# EAGLE design Pi MCU shield (EAGLE 6.4)
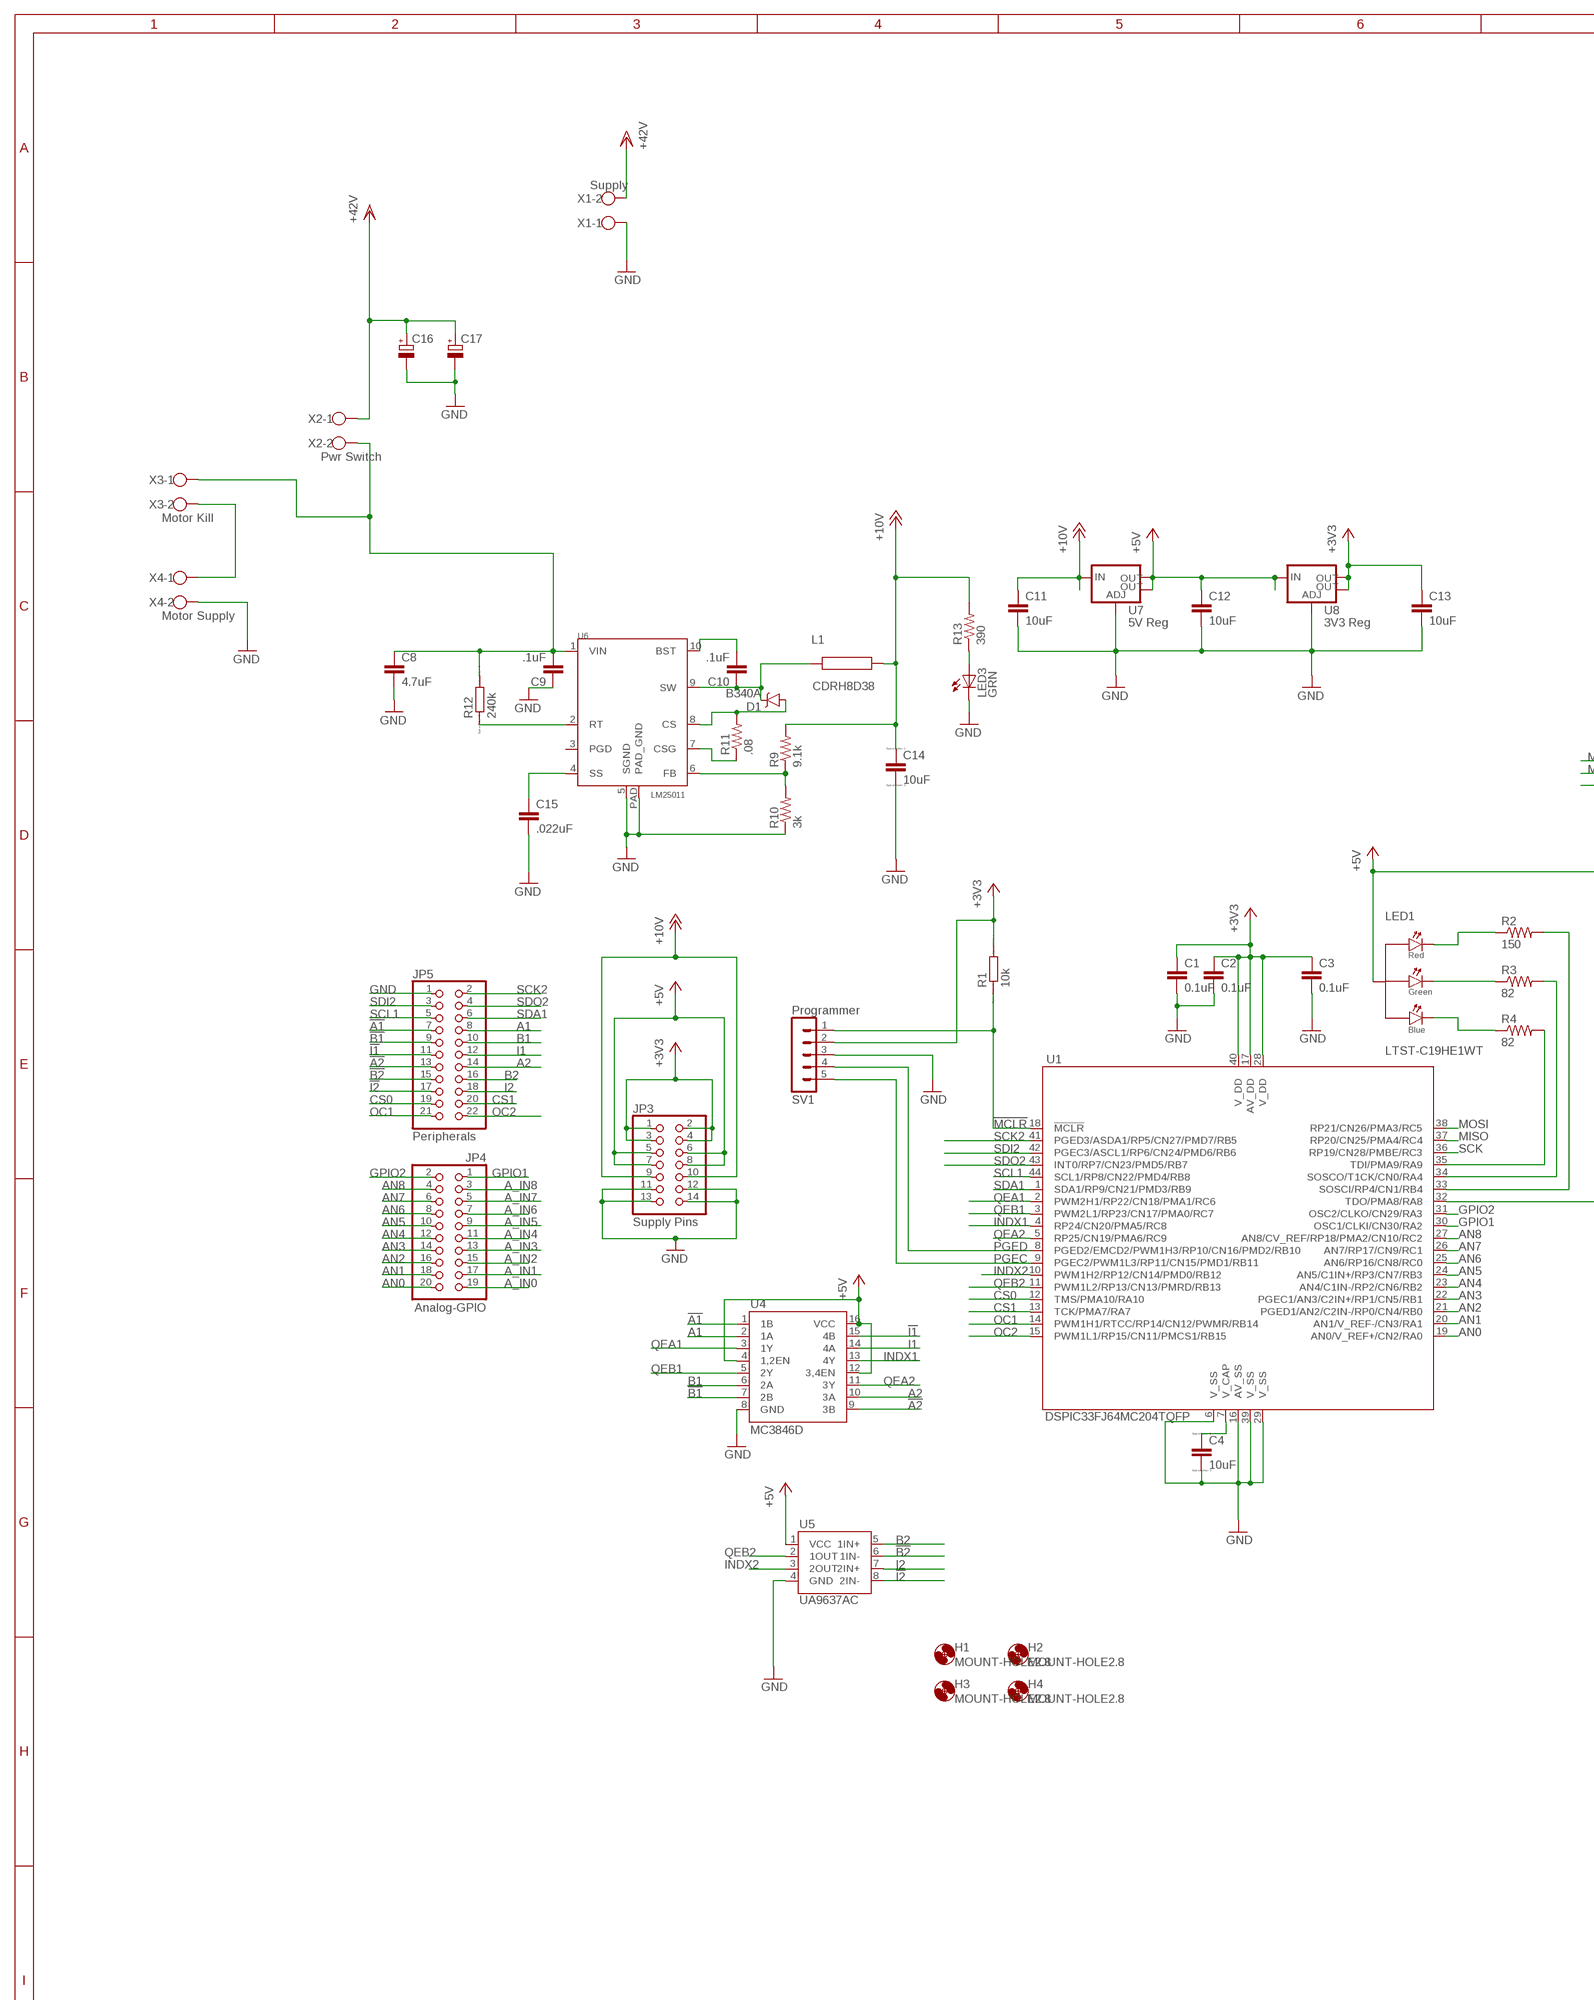
[diagram p0: schematic, sheet 1, part 1 of 2]
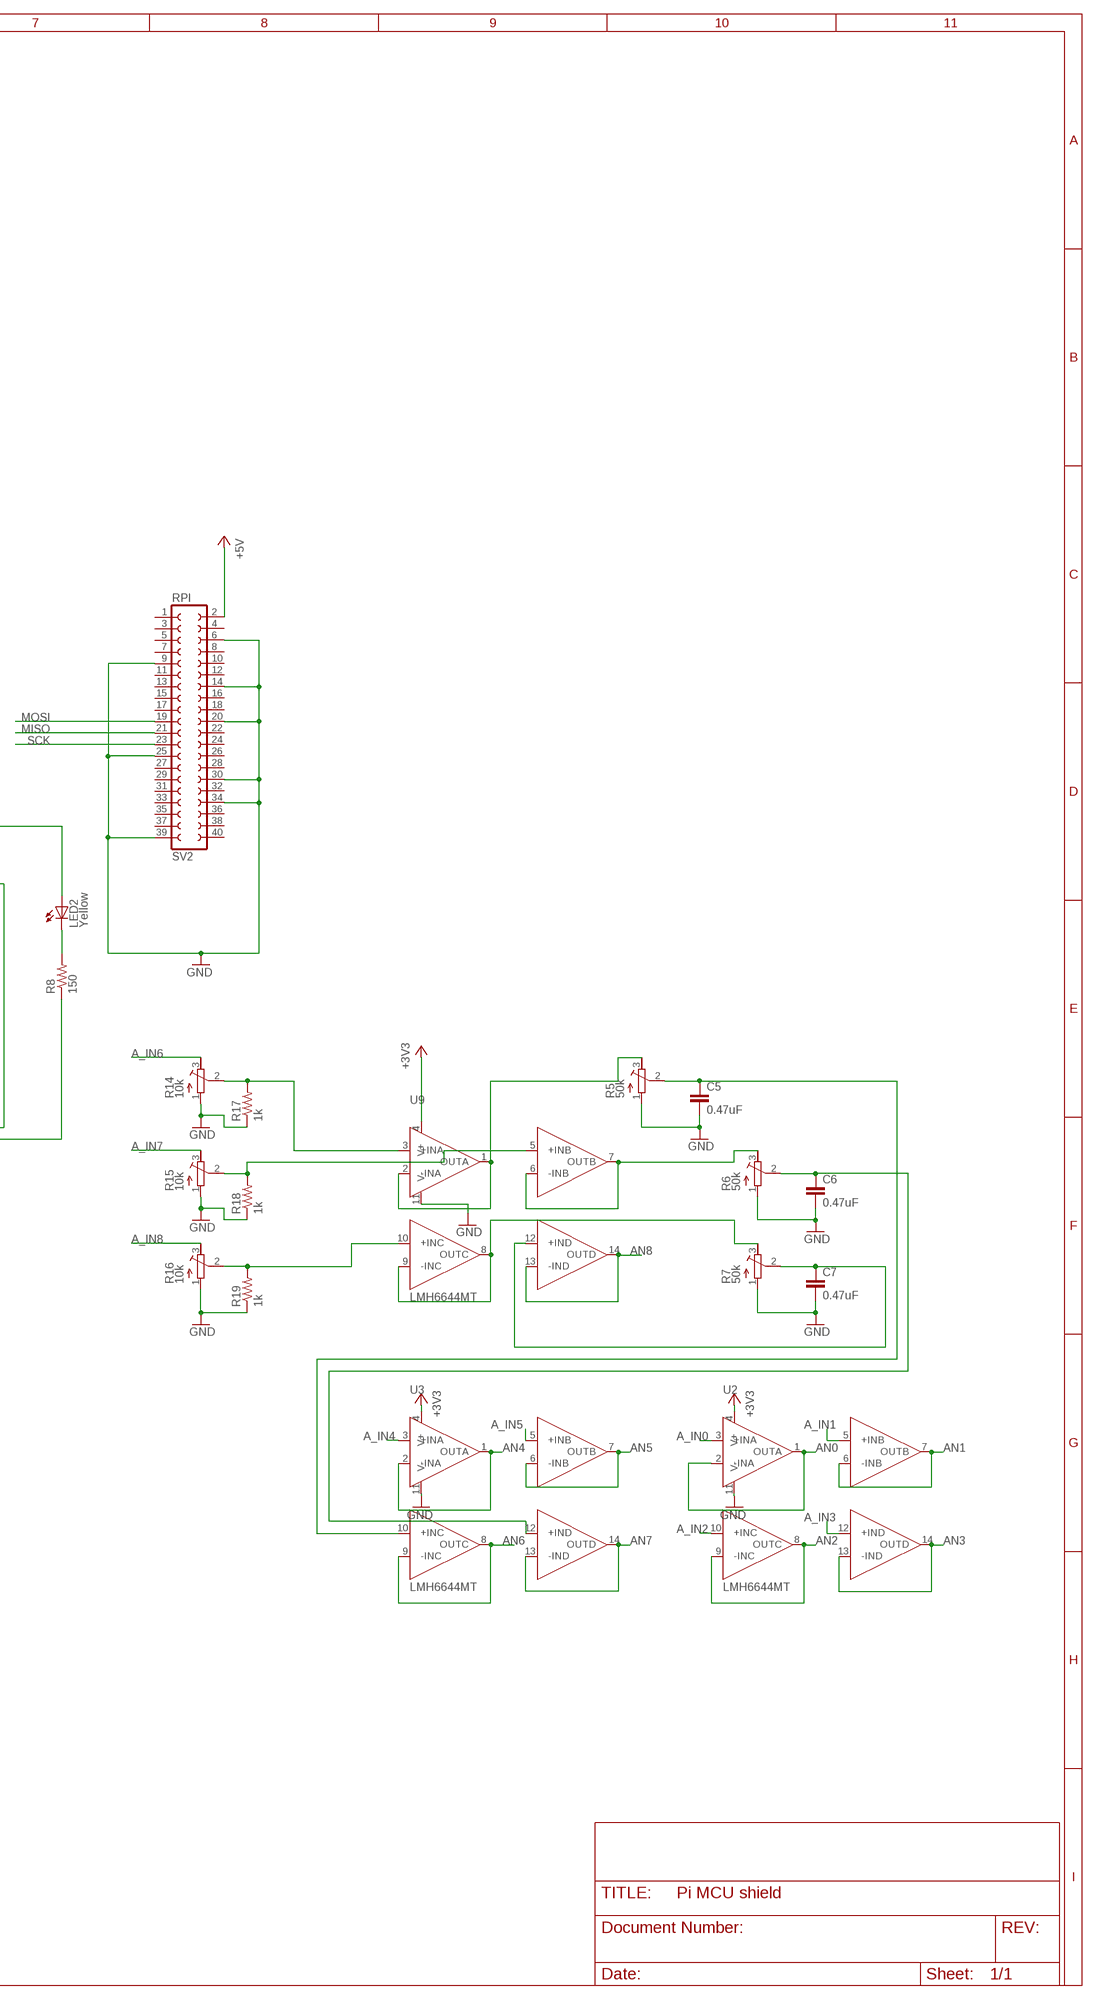
[diagram p1: schematic, sheet 1, part 2 of 2]

## Parts
C1  0.1uF  C-EUC0603  [C0603]
C2  0.1uF  C-EUC0603  [C0603]
C3  0.1uF  C-EUC0603  [C0603]
C4  10uF  CC1206  [C1206]
C5  0.47uF  C-EUC0603  [C0603]
C6  0.47uF  C-EUC0603  [C0603]
C7  0.47uF  C-EUC0603  [C0603]
C8  4.7uF  C-EUC1210  [C1210]
C9  .1uF  CAP0603-CAP  [0603-CAP]
C10  .1uF  CAP0603-CAP  [0603-CAP]
C11  10uF  C-EUC0805  [C0805]
C12  10uF  C-EUC0805  [C0805]
C13  10uF  C-EUC0805  [C0805]
C14  10uF  CC1206  [C1206]
C15  .022uF  CAP0603-CAP  [0603-CAP]
C16  CPOL-EUE5-13  [E5-13]
C17  CPOL-EUE5-13  [E5-13]
D1  B340A  DIODE-SCHOTTKY-B340A  [SMA-DIODE]
H1  MOUNT-HOLE2.8  [2,8]
H2  MOUNT-HOLE2.8  [2,8]
H3  MOUNT-HOLE2.8  [2,8]
H4  MOUNT-HOLE2.8  [2,8]
JP3  Supply Pins  PINHD-2X7  [2X07]
JP4  Analog-GPIO  PINHD-2X10  [2X10]
JP5  Peripherals  PINHD-2X11  [2X11]
L1  CDRH8D38  [CDRH8D38]
LED1  LTST-C19HE1WT  [0606]
LED2  Yellow  LEDSML0603  [SML0603]
LED3  GRN  LEDCHIP-LED0805  [CHIP-LED0805]
R1  10k  R  [R0805]
R2  150  R-US_R0603  [R0603]
R3  82  R-US_R0603  [R0603]
R4  82  R-US_R0603  [R0603]
R5  50k  R-TRIMM3224J  [RTRIM3224J]
R6  50k  R-TRIMM3224J  [RTRIM3224J]
R7  50k  R-TRIMM3224J  [RTRIM3224J]
R8  150  R-US_R0603  [R0603]
R9  9.1k  RESISTOR0603-RES  [0603-RES]
R10  3k  RESISTOR0603-RES  [0603-RES]
R11  .08  RESISTOR0603-RES  [0603-RES]
R12  240k  R  [R0805]
R13  390  RESISTOR0603-RES  [0603-RES]
R14  10k  R-TRIMM3224J  [RTRIM3224J]
R15  10k  R-TRIMM3224J  [RTRIM3224J]
R16  10k  R-TRIMM3224J  [RTRIM3224J]
R17  1k  R-US_R0603  [R0603]
R18  1k  R-US_R0603  [R0603]
R19  1k  R-US_R0603  [R0603]
SV1  Programmer  MA05-1  [MA05-1]
SV2  RPI  FE20-2  [FE20-2]
U1  DSPIC33FJ64MC204TQFP  [TQFP44]
U2  LMH6644MT  [TSSOP14]
U3  LMH6644MT  [TSSOP14]
U4  MC3846D  [SO-16]
U5  UA9637AC  [SO-08]
U6  LM25011  [HVSS0P-10]
U7  5V Reg  V_REG_LM1117SOT223  [SOT223]
U8  3V3 Reg  V_REG_LM1117SOT223  [SOT223]
U9  LMH6644MT  [TSSOP14]
X1  Supply  W237-102  [W237-102]
X2  Pwr Switch  W237-102  [W237-102]
X3  Motor Kill  W237-102  [W237-102]
X4  Motor Supply  W237-102  [W237-102]

## Nets
!A1: JP5.7 U4.1(1B)
!A2: JP5.13 U4.9(3B)
!B1: JP5.9 U4.7(2B)
!B2: JP5.15 U5.6(1IN-)
!I1: JP5.11 U4.15(4B)
!I2: JP5.17 U5.8(2IN-)
!MCLR: R1.1 SV1.1 U1.18(!MCLR)
+3V3: C1.1 C2.1 C3.1 C13.1 JP3.1 JP3.2 JP3.3 JP3.4 R1.2 SV1.2 U1.17(AV_DD) U1.28(V_DD) U1.40(V_DD) U2.4(V+) U3.4(V+) U8.2(OUT) U8.4(OUT) U9.4(V+)
+5V: C12.1 JP3.5 JP3.6 JP3.7 JP3.8 LED1.4(ANODE) LED2.A SV2.2 U4.4(1,2EN) U4.12(3,4EN) U4.16(VCC) U5.1(VCC) U7.2(OUT) U7.4(OUT) U8.3(IN)
+10V: C11.1 C14.1 JP3.9 JP3.10 L1.P$2 R9.2 R13.2 U7.3(IN)
A1: JP5.8 U4.2(1A)
A2: JP5.14 U4.10(3A)
A_IN0: JP4.19 U2.3(+INA)
A_IN1: JP4.17 U2.5(+INB)
A_IN2: JP4.15 U2.10(+INC)
A_IN3: JP4.13 U2.12(+IND)
A_IN4: JP4.11 U3.3(+INA)
A_IN5: JP4.9 U3.5(+INB)
A_IN6: JP4.7 R14.3(E)
A_IN7: JP4.5 R15.3(E)
A_IN8: JP4.3 R16.3(E)
AN0: JP4.20 U1.19(AN0/V_REF+/CN2/RA0) U2.1(OUTA) U2.2(-INA)
AN1: JP4.18 U1.20(AN1/V_REF-/CN3/RA1) U2.6(-INB) U2.7(OUTB)
AN2: JP4.16 U1.21(PGED1/AN2/C2IN-/RP0/CN4/RB0) U2.8(OUTC) U2.9(-INC)
AN3: JP4.14 U1.22(PGEC1/AN3/C2IN+/RP1/CN5/RB1) U2.13(-IND) U2.14(OUTD)
AN4: JP4.12 U1.23(AN4/C1IN-/RP2/CN6/RB2) U3.1(OUTA) U3.2(-INA)
AN5: JP4.10 U1.24(AN5/C1IN+/RP3/CN7/RB3) U3.6(-INB) U3.7(OUTB)
AN6: JP4.8 U1.25(AN6/RP16/CN8/RC0) U3.8(OUTC) U3.9(-INC)
AN7: JP4.6 U1.26(AN7/RP17/CN9/RC1) U3.13(-IND) U3.14(OUTD)
AN8: JP4.4 U1.27(AN8/CV_REF/RP18/PMA2/CN10/RC2) U9.13(-IND) U9.14(OUTD)
B1: JP5.10 U4.6(2A)
B2: JP5.16 U5.5(1IN+)
BLUE: LED1.2(G_CATHODE) R3.1
CS0: JP5.19 U1.12(TMS/PMA10/RA10)
CS1: JP5.20 U1.13(TCK/PMA7/RA7)
GND: C1.2 C2.2 C3.2 C4.2 C5.2 C6.2 C7.2 C8.2 C9.1 C11.2 C12.2 C13.2 C14.2 C15.2 C16.- C17.- JP3.11 JP3.12 JP3.13 JP3.14 JP5.1 LED3.C R5.1(A) R6.1(A) R7.1(A) R10.1 R14.1(A) R15.1(A) R16.1(A) R17.1 R18.1 R19.1 SV1.3 SV2.6 SV2.9 SV2.14 SV2.20 SV2.25 SV2.30 SV2.34 SV2.39 U1.6(V_SS) U1.16(AV_SS) U1.29(V_SS) U1.39(V_SS) U2.11(V-) U3.11(V-) U4.8(GND) U5.4(GND) U6.5(SGND) U6.PAD(PAD_GND) U7.1(ADJ) U8.1(ADJ) U9.11(V-) X1.1 X4.2
GPIO1: JP4.1 U1.30(OSC1/CLKI/CN30/RA2)
GPIO2: JP4.2 U1.31(OSC2/CLKO/CN29/RA3)
GREEN: LED1.3(B_CATHODE) R4.1
I1: JP5.12 U4.14(4A)
I2: JP5.18 U5.7(2IN+)
INDX1: U1.4(RP24/CN20/PMA5/RC8) U4.13(4Y)
INDX2: U1.10(PWM1H2/RP12/CN14/PMD0/RB12) U5.3(2OUT)
MISO: SV2.21 U1.37(RP20/CN25/PMA4/RC4)
MOSI: SV2.19 U1.38(RP21/CN26/PMA3/RC5)
N$1: R15.2(S) R18.2 U9.5(+INB)
N$2: C4.1 U1.7(V_CAP)
N$3: C8.1 C9.2 R12.2 U6.1(VIN) X2.2 X3.1
N$4: C7.1 R7.2(S) U9.12(+IND)
N$5: C5.1 R5.2(S) U3.10(+INC)
N$7: X3.2 X4.1
N$10: R14.2(S) R17.2 U9.3(+INA)
N$16: R6.3(E) U9.6(-INB) U9.7(OUTB)
N$18: R7.3(E) U9.8(OUTC) U9.9(-INC)
N$23: LED3.A R13.1
N$25: LED2.C R8.2
N$28: R4.2 U1.35(TDI/PMA9/RA9)
N$29: R3.2 U1.34(SOSCO/T1CK/CN0/RA4)
N$30: R2.2 U1.33(SOSCI/RP4/CN1/RB4)
N$31: R16.2(S) R19.2 U9.10(+INC)
N$32: R8.1 U1.32(TDO/PMA8/RA8)
N$33: C10.1 D1.C L1.P$1 U6.9(SW)
N$35: R9.1 R10.2 U6.6(FB)
N$36: R12.1 U6.2(RT)
N$37: C15.1 U6.4(SS)
N$38: D1.A R11.2 U6.8(CS)
N$39: C10.2 U6.10(BST)
N$40: R11.1 U6.7(CSG)
N$44: R5.3(E) U9.1(OUTA) U9.2(-INA)
N$57: C6.1 R6.2(S) U3.12(+IND)
OC1: JP5.21 U1.14(PWM1H1/RTCC/RP14/CN12/PWMR/RB14)
OC2: JP5.22 U1.15(PWM1L1/RP15/CN11/PMCS1/RB15)
PGEC: SV1.5 U1.9(PGEC2/PWM1L3/RP11/CN15/PMD1/RB11)
PGED: SV1.4 U1.8(PGED2/EMCD2/PWM1H3/RP10/CN16/PMD2/RB10)
QEA1: U1.2(PWM2H1/RP22/CN18/PMA1/RC6) U4.3(1Y)
QEA2: U1.5(RP25/CN19/PMA6/RC9) U4.11(3Y)
QEB1: U1.3(PWM2L1/RP23/CN17/PMA0/RC7) U4.5(2Y)
QEB2: U1.11(PWM1L2/RP13/CN13/PMRD/RB13) U5.2(1OUT)
RED: LED1.1(R_CATHODE) R2.1
SCK: SV2.23 U1.36(RP19/CN28/PMBE/RC3)
SCK2: JP5.2 U1.41(PGED3/ASDA1/RP5/CN27/PMD7/RB5)
SCL1: JP5.5 U1.44(SCL1/RP8/CN22/PMD4/RB8)
SDA1: JP5.6 U1.1(SDA1/RP9/CN21/PMD3/RB9)
SDI2: JP5.3 U1.42(PGEC3/ASCL1/RP6/CN24/PMD6/RB6)
SDO2: JP5.4 U1.43(INT0/RP7/CN23/PMD5/RB7)
VDD: C16.+ C17.+ X1.2 X2.1 ; supply symbol labelled +42V
Unconnected: SV2.1 SV2.3 SV2.4 SV2.5 SV2.7 SV2.8 SV2.10 SV2.11 SV2.12 SV2.13 SV2.15 SV2.16 SV2.17 SV2.18 SV2.22 SV2.24 SV2.26 SV2.27 SV2.28 SV2.29 SV2.31 SV2.32 SV2.33 SV2.35 SV2.36 SV2.37 SV2.38 SV2.40 U6.3(PGD)

## Library data of the parts
C1-C3 C5-C8 C11-C13 = resistor:C-EU: CAPACITOR, European symbol
C4 C14 = eagle-ltspice:C: CAPACITOR, European symbol; SPICEMODEL: NONE; SPICEPREFIX: C
C9 C10 C15 = SparkFun-Capacitors:CAP: Capacitor Standard 0603 ceramic capacitor, and 0.1" leaded capacitor.
C16 C17 = resistor:CPOL-EU: POLARIZED CAPACITOR, European symbol
D1 = SparkFun-DiscreteSemi:DIODE-SCHOTTKY: Schottky diodes in SFE's production catalog BAT20J 1A 23V 0.62Vf RB751 120mA 40V 0.37Vf PMEG4005EJ 0.5A 40V 0.42Vf MBRA140 1A 40V 0.5Vf B340A 3A 40V SMA; PROD_ID: DIO-09886
H1-H4 = holes:MOUNT-HOLE: MOUNTING HOLE with drill center marker
JP3 = pinhead:PINHD-2X7: PIN HEADER
JP4 = pinhead:PINHD-2X10: PIN HEADER
JP5 = pinhead:PINHD-2X11: PIN HEADER
L1 = sumida:CDRH8D38: Power Inductor - 1.8uH to 100 uH, 4mm tall, shielded
LED1 = led:LTST-C19HE1WT: RGB LED, common cathode. Vf ~ 3.3V (B, G), 2.1V (R) at 20mA.
LED2 LED3 = led:LED: LED OSRAM: - CHIPLED LG R971, LG N971, LY N971, LG Q971, LY Q971, LO R971, LY R971 LH N974, LH R974 LS Q976, LO Q976, LY Q976 LO Q996 - Hyper CHIPLED LW Q18S LB Q993, LB Q99A, LB R99A - SideLED LS A670, LO A670, LY A670, LG A670, LP A670 LB A673, LV A673, LT A673, LW A673 LH A674 LY A675 LS A676, LA A676, LO A676, LY A676, LW A676 LS A679, LY A679, LG A679 - Hyper Micro SIDELED® LS Y876, LA Y876, LO Y876, LY Y876 LT Y87S - SmartLED LW L88C, LW L88S LB L89C, LB L89S, LG L890 LS L89K, LO L89K, LY L89K LS L896, LA L896, LO L896, LY L896 - TOPLED LS T670, LO T670, LY T670, LG T670, LP T670 LSG T670, LSP T670, LSY T670, LOP T670, LYG T670 LG T671, LOG T671, LSG T671 LB T673, LV T673, LT T673, LW T673 LH T674 LS T676, LA T676, LO T676, LY T676, LB T676, LH T676, LSB T676, LW T676 LB T67C, LV T67C, LT T67C, LS T67K, LO T67K, LY T67K, LW E67C LS E67B, LA E67B, LO E67B, LY E67B, LB E67C, LV E67C, LT E67C LW T67C LS T679, LY T679, LG T679 LS T770, LO T770, LY T770, LG T770, LP T770 LB T773, LV T773, LT T773, LW T773 LH T774 LS E675, LA E675, LY E675, LS T675 LS T776, LA T776, LO T776, LY T776, LB T776 LHGB T686 LT T68C, LB T68C - Hyper Mini TOPLED® LB M676 - Mini TOPLED Santana® LG M470 LS M47K, LO M47K, LY M47K Source: http://www.osram.convergy.de LUXEON: - LUMILED® LXK2-PW12-R00, LXK2-PW12-S00, LXK2-PW14-U00, LXK2-PW14-V00 LXK2-PM12-R00, LXK2-PM12-S00, LXK2-PM14-U00 LXK2-PE12-Q00, LXK2-PE12-R00, LXK2-PE12-S00, LXK2-PE14-T00, LXK2-PE14-U00 LXK2-PB12-K00, LXK2-PB12-L00, LXK2-PB12-M00, LXK2-PB14-N00, LXK2-PB14-P00, LXK2-PB14-Q00 LXK2-PR12-L00, LXK2-PR12-M00, LXK2-PR14-Q00, LXK2-PR14-R00 LXK2-PD12-Q00, LXK2-PD12-R00, LXK2-PD12-S00 LXK2-PH12-R00, LXK2-PH12-S00 LXK2-PL12-P00, LXK2-PL12-Q00, LXK2-PL12-R00 Source: www.luxeon.com KINGBRIGHT: KA-3528ASYC Source: www.kingbright.com
R1 R12 = eagle-ltspice:R: RESISTOR, European symbol; SPICEMODEL: NONE; SPICEPREFIX: R
R2-R4 R8 R17-R19 = resistor:R-US_: RESISTOR, American symbol
R5-R7 R14-R16 = rcl:R-TRIMM: Trimm resistor
R9-R11 R13 = SparkFun-Resistors:RESISTOR: Resistor Basic schematic elements and footprints for 0603, 1206, and PTH resistors.
SV1 = con-lstb:MA05-1: PIN HEADER; OC_FARNELL: unknown; OC_NEWARK: unknown
SV2 = con-lsta:FE20-2: FEMALE HEADER; OC_FARNELL: unknown; OC_NEWARK: unknown
U1 = microchip:DSPIC33FJ64MC204: A 16-bit microcontroller/digital signal processor with 26 reprogrammable i/o pins,35 total i/o pins, and support for encoders, pwm output (output compare), input capture, SPI/I2C/UART serial communication, and 9 ADC channels.
U2 U3 U9 = texas:LMH6644: Fast op amps for ADC buffering. 130 MHz, full power bandwidth 40MHz, 130V/us slew rate.
U4 = texas:MC3846: Quadruple differential line receiver. 5V supply, 3 state output.
U5 = texas:UA9637AC: Dual differential line receiver, 5V supply, 8 pins.
U6 = SparkFun-PowerIC:LM25011: The LM25011 constant on-time step-down switching regulator features all the functions needed to implement a low-cost, efficient, buck bias regulator capable of supplying up to 2 A of load current. This high-voltage regulator contains an N-Channel Buck switch, a startup regulator, current limit detection, and internal ripple control.; PROD_ID: IC-12528
U7 U8 = SparkFun-PowerIC:V_REG_LM1117: Voltage Regulator LM1117 Standard adjustable voltage regulator but in SMD form. Spark Fun Electronics SKU : COM-00595; PROD_ID: VREG-08170
X1-X4 = con-wago-500:W237-102: WAGO SCREW CLAMP; MPN: 237-102; OC_FARNELL: unknown; OC_NEWARK: 70K9898

## Board
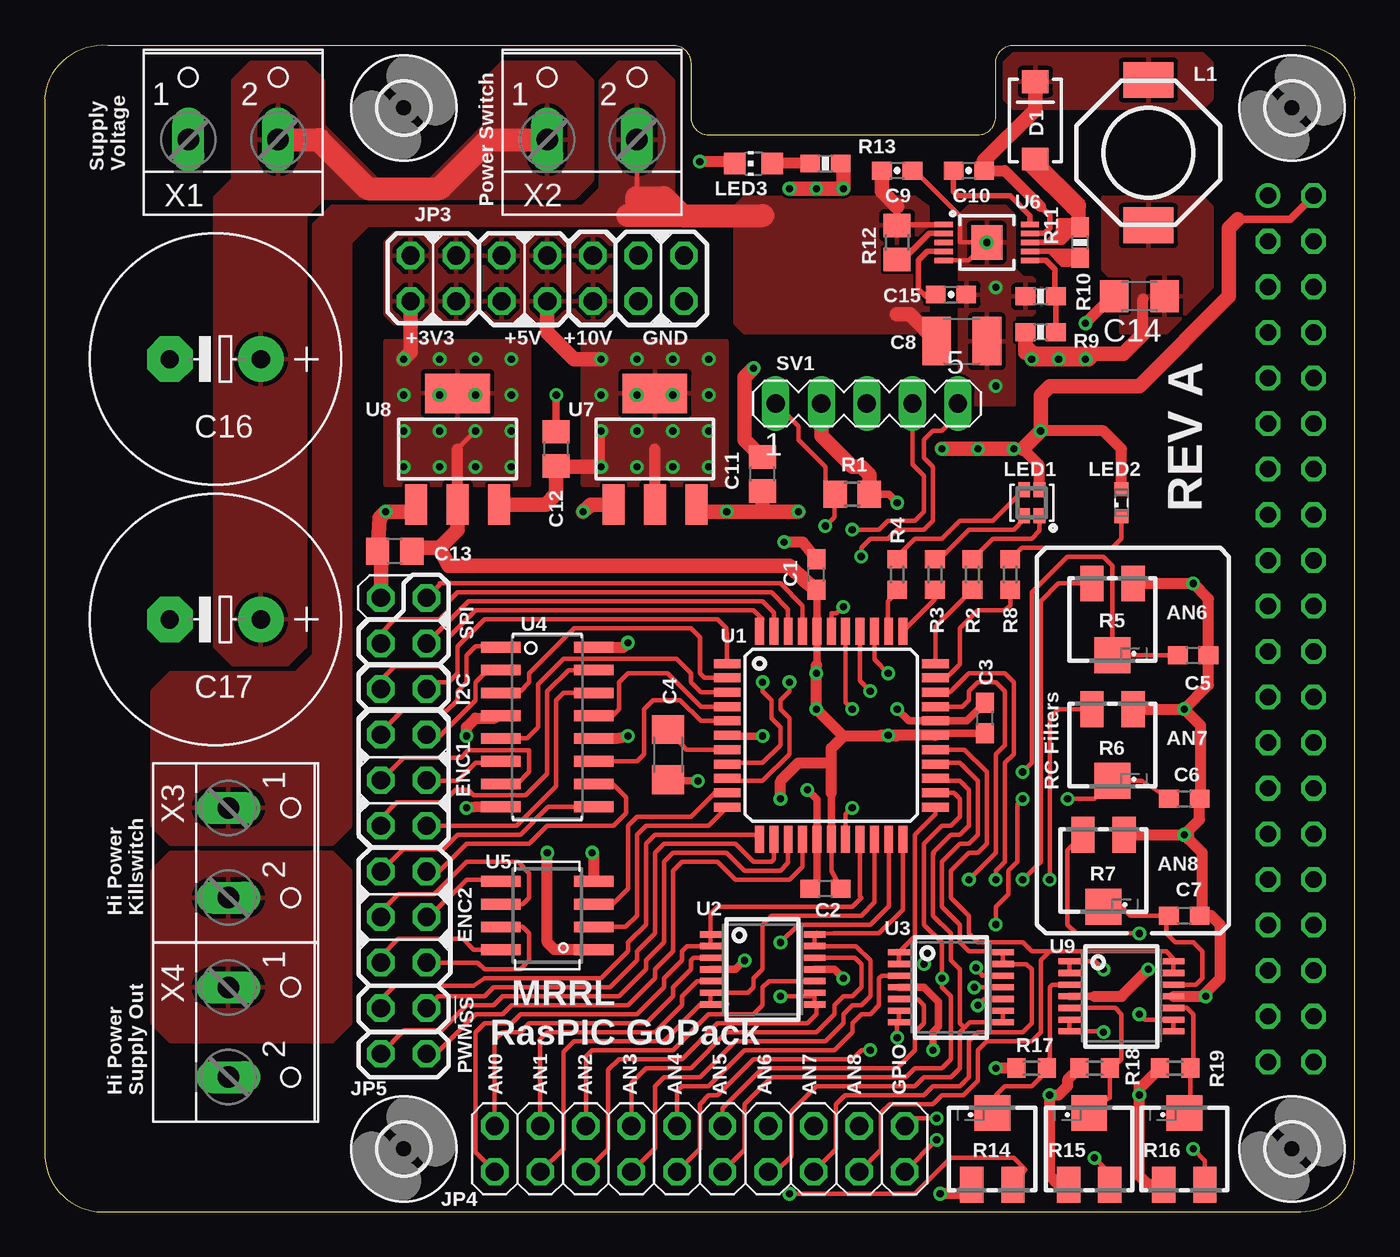
[diagram p2: board, top side]
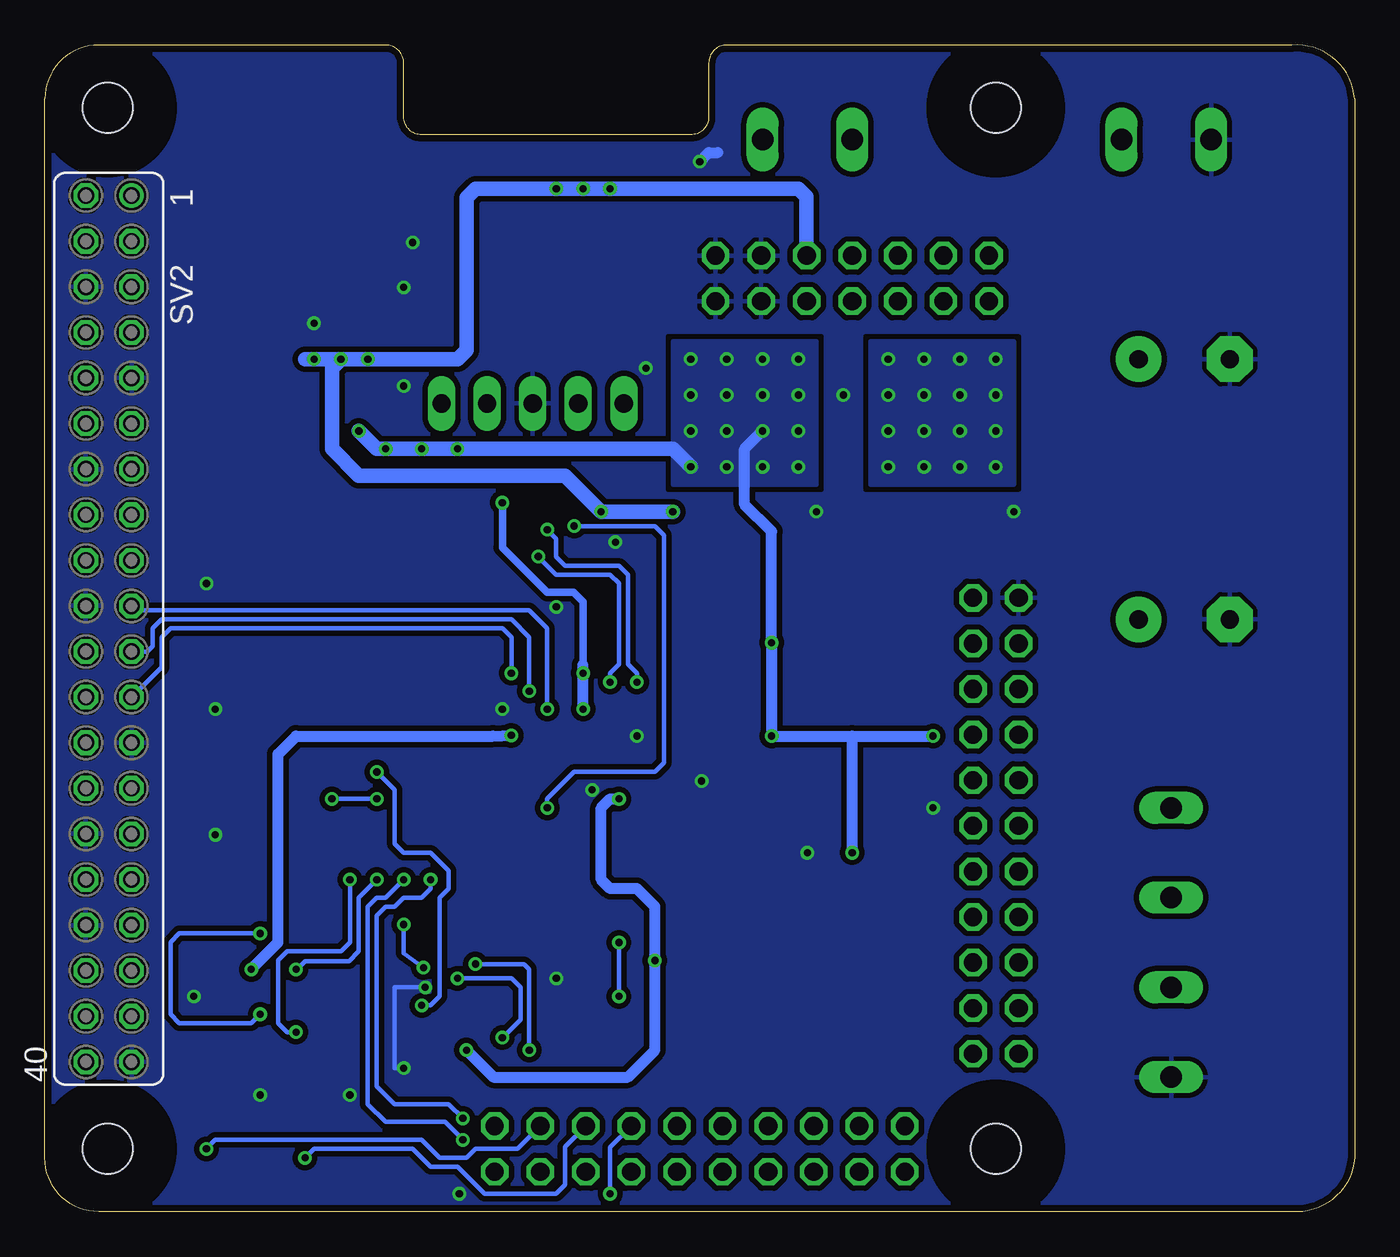
[diagram p3: board, bottom side, seen from below]

Size 73 x 65.02 mm. Coordinates in mm from the lower left corner, seen from the top.
Outline: 54,65.01 70,65.01 arc-90 73,62.01 73,3.01 arc-90 70,0.01 3.5,0.01 arc-90 0,3.01 0,62.01 arc-90 3.5,65.01 35,65.01 arc-90 36,64.01 36,61.01 arc90 37,60.01 52,60.01 arc90 53,61.01 53,64.01 arc-90 54,65.01
Copper layers (1*16): Top 0.0356mm / dielectric 1.5011mm / Bottom 0.0356mm
Design rules "OSHPark *": minimum track width 6mil, minimum drill 13mil, track to track 6mil, track to pad 6mil, pad to pad 6mil, via to via 6mil, smd to smd 6mil, copper to edge 15mil, drill to drill 6mil, minimum pad ring 7mil, minimum via ring 7mil, stop-mask expansion 4mil, vias tented up to drill 20mil, thermal gap 10mil

### Footprints (pad centres in the part's own frame; a part is rotated, then mirrored left to right if it is on the bottom)
C0603 = smd 1.1 x 1: 1 -0.85,0; 2 0.85,0
C1206 = smd 1.6 x 1.8: 1 -1.4,0; 2 1.4,0
C1210 = smd 1.6 x 2.7: 1 -1.4,0; 2 1.4,0
0603-CAP = smd 1.1 x 1: 1 -0.85,0; 2 0.85,0
C0805 = smd 1.3 x 1.5: 1 -0.95,0; 2 0.95,0
E5-13 = drill 1.016 pad 2.54: + -2.54,0 | drill 1.016 pad 2.54 octagon: - 2.54,0
SMA-DIODE = smd 1.27 x 1.47: A -2.15,0; C 2.15,0
2,8 = hole 2.8: 0,0
2X07 = drill 1.016 octagon: 1 -7.62,-1.27; 2 -7.62,1.27; 3 -5.08,-1.27; 4 -5.08,1.27; 5 -2.54,-1.27; 6 -2.54,1.27; 7 0,-1.27; 8 0,1.27; 9 2.54,-1.27; 10 2.54,1.27; 11 5.08,-1.27; 12 5.08,1.27; 13 7.62,-1.27; 14 7.62,1.27
2X10 = drill 1.016 octagon: 1 -11.43,-1.27; 2 -11.43,1.27; 3 -8.89,-1.27; 4 -8.89,1.27; 5 -6.35,-1.27; 6 -6.35,1.27; 7 -3.81,-1.27; 8 -3.81,1.27; 9 -1.27,-1.27; 10 -1.27,1.27; 11 1.27,-1.27; 12 1.27,1.27; 13 3.81,-1.27; 14 3.81,1.27; 15 6.35,-1.27; 16 6.35,1.27; 17 8.89,-1.27; 18 8.89,1.27; 19 11.43,-1.27; 20 11.43,1.27
2X11 = drill 1.016 octagon: 1 -12.7,-1.27; 2 -12.7,1.27; 3 -10.16,-1.27; 4 -10.16,1.27; 5 -7.62,-1.27; 6 -7.62,1.27; 7 -5.08,-1.27; 8 -5.08,1.27; 9 -2.54,-1.27; 10 -2.54,1.27; 11 0,-1.27; 12 0,1.27; 13 2.54,-1.27; 14 2.54,1.27; 15 5.08,-1.27; 16 5.08,1.27; 17 7.62,-1.27; 18 7.62,1.27; 19 10.16,-1.27; 20 10.16,1.27; 21 12.7,-1.27; 22 12.7,1.27
CDRH8D38 = smd 2 x 2.8: P$1 4.05,0; P$2 -4.05,0
0606 = smd 0.65 x 0.85: 1 -0.425,0.725; 2 0.425,0.725; 3 0.425,-0.725; 4 -0.425,-0.725
SML0603 = smd 0.8 x 0.8: A 0.75,0; C -0.75,0
CHIP-LED0805 = smd 1.2 x 1.2: A 0,-1.05; C 0,1.05
R0805 = smd 1.3 x 1.5: 1 -0.95,0; 2 0.95,0
R0603 = smd 1 x 1.1: 1 -0.85,0; 2 0.85,0
RTRIM3224J = smd 1.3 x 2: 1 -1.15,-2; 3 1.15,-2 | smd 2 x 2: 2 0,2
0603-RES = smd 1.1 x 1: 1 -0.85,0; 2 0.85,0
MA05-1 = drill 1.016 long: 1 -5.08,0; 2 -2.54,0; 3 0,0; 4 2.54,0; 5 5.08,0
FE20-2 = drill 0.914: 1 -24.13,1.27 | drill 0.914 octagon: 2 -24.13,-1.27; 3 -21.59,1.27; 4 -21.59,-1.27; 5 -19.05,1.27; 6 -19.05,-1.27; 7 -16.51,1.27; 8 -16.51,-1.27; 9 -13.97,1.27; 10 -13.97,-1.27; 11 -11.43,1.27; 12 -11.43,-1.27; 13 -8.89,1.27; 14 -8.89,-1.27; 15 -6.35,1.27; 16 -6.35,-1.27; 17 -3.81,1.27; 18 -3.81,-1.27; 19 -1.27,1.27; 20 -1.27,-1.27; 21 1.27,1.27; 22 1.27,-1.27; 23 3.81,1.27; 24 3.81,-1.27; 25 6.35,1.27; 26 6.35,-1.27; 27 8.89,1.27; 28 8.89,-1.27; 29 11.43,1.27; 30 11.43,-1.27; 31 13.97,1.27; 32 13.97,-1.27; 33 16.51,1.27; 34 16.51,-1.27; 35 19.05,1.27; 36 19.05,-1.27; 37 21.59,1.27; 38 21.59,-1.27; 39 24.13,1.27; 40 24.13,-1.27
TQFP44 = smd 1.5 x 0.5: 1 -5.8,4; 2 -5.8,3.2; 3 -5.8,2.4; 4 -5.8,1.6; 5 -5.8,0.8; 6 -5.8,0; 7 -5.8,-0.8; 8 -5.8,-1.6; 9 -5.8,-2.4; 10 -5.8,-3.2; 11 -5.8,-4; 23 5.8,-4; 24 5.8,-3.2; 25 5.8,-2.4; 26 5.8,-1.6; 27 5.8,-0.8; 28 5.8,0; 29 5.8,0.8; 30 5.8,1.6; 31 5.8,2.4; 32 5.8,3.2; 33 5.8,4 | smd 0.5 x 1.5: 12 -4,-5.8; 13 -3.2,-5.8; 14 -2.4,-5.8; 15 -1.6,-5.8; 16 -0.8,-5.8; 17 0,-5.8; 18 0.8,-5.8; 19 1.6,-5.8; 20 2.4,-5.8; 21 3.2,-5.8; 22 4,-5.8; 34 4,5.8; 35 3.2,5.8; 36 2.4,5.8; 37 1.6,5.8; 38 0.8,5.8; 39 0,5.8; 40 -0.8,5.8; 41 -1.6,5.8; 42 -2.4,5.8; 43 -3.2,5.8; 44 -4,5.8
TSSOP14 = smd 0.35 x 1.2: 1 -1.95,-2.9; 2 -1.3,-2.9; 3 -0.65,-2.9; 4 0,-2.9; 5 0.65,-2.9; 6 1.3,-2.9; 7 1.95,-2.9; 8 1.95,2.9; 9 1.3,2.9; 10 0.65,2.9; 11 0,2.9; 12 -0.65,2.9; 13 -1.3,2.9; 14 -1.95,2.9
SO-16 = smd 0.6 x 2.2: 1 -4.445,-2.6; 2 -3.175,-2.6; 3 -1.905,-2.6; 4 -0.635,-2.6; 5 0.635,-2.6; 6 1.905,-2.6; 7 3.175,-2.6; 8 4.445,-2.6; 9 4.445,2.6; 10 3.175,2.6; 11 1.905,2.6; 12 0.635,2.6; 13 -0.635,2.6; 14 -1.905,2.6; 15 -3.175,2.6; 16 -4.445,2.6
SO-08 = smd 0.6 x 2.2: 1 -1.905,-2.6; 2 -0.635,-2.6; 3 0.635,-2.6; 4 1.905,-2.6; 6 0.635,2.6; 7 -0.635,2.6; 8 -1.905,2.6 | smd 0.61 x 2.2: 5 1.905,2.6
HVSS0P-10 = smd 0.3 x 1.02: 1 -1,-2.4; 2 -0.5,-2.4; 3 0,-2.4; 4 0.5,-2.4; 5 1,-2.4; 6 1,2.4; 7 0.5,2.4; 8 0,2.4; 9 -0.5,2.4; 10 -1,2.4 | smd 1.905 x 1.727: PAD 0,0
SOT223 = smd 1.219 x 2.235: 1 -2.311,-3.099; 2 0,-3.099; 3 2.311,-3.099 | smd 3.6 x 2.2: 4 0,3.099
W237-102 = drill 1.194 long: 1 -2.5,-1.27; 2 2.5,-1.27

### Placement (x,y rotation side)
C1  43,35.51 90 top
C2  43.5,18.01 180 top
C3  52.4,27.51 90 top
C4  34.73,25.47 270 top
C5  64,31.01 0 top
C6  63.5,23.01 0 top
C7  63.5,16.51 0 top
C8  51.1,48.51 0 top
C9  47.5,58.01 180 top
C10  51.5,58.01 180 top
C11  40,41.11 90 top
C12  28.5,42.51 90 top
C13  19.5,36.81 180 top
C14  61,51.01 180 top
C15  50.5,51.11 0 top
C16  9.5,47.51 180 top
C17  9.5,33.01 180 top
D1  55.2,60.81 90 top
H1  20,3.51 0 top
H2  69.5,3.51 0 top
H3  20,61.51 0 top
H4  69.5,61.51 0 top
JP3  28,52.01 0 top
JP4  36.5,3.51 180 top
JP5  20,21.51 270 top
L1  61.5,59.01 90 top
LED1  55,39.51 180 top
LED2  60,39.51 90 top
LED3  39.5,58.41 90 top
R1  45,39.98 0 top
R2  51.7,35.51 270 top
R3  49.6,35.51 270 top
R4  47.5,35.51 270 top
R5  59.5,33.01 180 top
R6  59.5,26.01 180 top
R7  59,19.01 180 top
R8  53.8,35.51 90 top
R9  55.5,49.01 180 top
R10  55.5,51.01 0 top
R11  57.7,54.01 90 top
R12  47.5,54.01 90 top
R13  43.5,58.41 0 top
R14  52.8,3.51 0 top
R15  58.2,3.51 0 top
R16  63.5,3.51 0 top
R17  55,8.01 0 top
R18  58.5,8.01 0 top
R19  63,8.01 0 top
SV1  45.81,45.04 0 top
SV2  69.44,32.49 270 bottom
U1  43.83,26.55 0 top
U2  40,13.51 270 top
U3  50.5,12.51 270 top
U4  28,27.01 270 top
U5  28,16.51 90 top
U6  52.5,54.01 270 top
U7  34,42.51 0 top
U8  23,42.51 0 top
U9  60,12.01 270 top
X1  10.5,61.01 0 top
X2  30.5,61.01 0 top
X3  11.5,20.01 270 top
X4  11.5,10.01 270 top

### Tracks (layer width: path | path; a pad name or v marks a point on that pad's centre or on a via)
!A1
  Top 0.254: 24.55,31.45 U4.1 25.15,31.51 24,31.51 23.5,31.01 23.5,29.51 23,29.01 23,28.51 22.4,27.91 19.9,27.91 18.73,26.74 JP5.7
!A2
  Top 0.254: U4.9 28.05,22.56 26.5,21.01 23,21.01 22.2,20.21 19.97,20.21 JP5.13
!B1
  Top 0.254: U4.7 26.32,23.83 27,24.51 27,25.71 23.6,25.71 23.2,25.31 19.99,25.31 JP5.9
!B2
  Top 0.254: U5.6 26.64,17.14 27,17.51 27,18.87 26.36,19.51 23.5,19.51 21.7,17.71 19.7,17.71 18.73,16.74 JP5.15
!I1
  Top 0.254: U4.15 29.18,30.18 28,29.01 28,24.41 26.8,23.21 23.9,23.21 23.6,23.51 22.9,23.51 22.2,22.81 19.6,22.81 18.73,21.94 JP5.11
!I2
  Top 0.254: U5.8 23.91,14.6 23.3,15.21 19.7,15.21 18.73,14.24 JP5.17
!MCLR  (via drill 0.4)
  Top 0.254: SV1.1 42,43.77 42,43.01 43.5,41.51 43.5,40.53 R1.1 43.95,39.56 44,39.51 44,38.71 v43.5,38.21 | v45,22.51 44.63,22.14 U1.18
  Bottom 0.254: v45,22.51 45,23.01 43.5,24.51 39,24.51 38.5,25.01 38.5,37.71 39,38.21 v43.5,38.21
+3V3  (via drill 0.4)
  Top 0.254: 23,42.51 v24,43.51 | U1.17 43.83,19.03 C2.1 | U1.28 49.74,26.66 | 46.54,26.55 47.5,26.51 | U1.40 43.02,33.5
  Top 0.406: 43.03,33.13 43.02,33.5 C1.1 | 49.74,26.66 C3.1 | 43.03,30.48 U1.40 | 43.83,23.34 U1.17 | R1.2 47.03,39.98 v47.5,39.51 | U2.4 38.5,13.51 v39,14.01 | U3.4 49,12.51 49.8,11.71 49.8,10.31 49.5,10.01 v49.5,9.01 | U9.4 58.5,12.01
  Top 0.61: U8.2 23,42.51 | U1.28 v47,26.55 46.54,26.55 | 47.5,26.51 44.5,26.51 | 44.5,26.51 v43,28.01 v43,30.01 43,30.45 43.03,30.48 | 43.83,23.34 43.83,25.01 | 43.83,25.01 43.83,25.84 44.5,26.51 | v41,23.01 41,24.01 42,25.01 43.83,25.01 | v61.5,13.51 60,12.01 58.5,12.01
  Top 0.813: U8.2 23,38.01 22,37.01 | JP3.1 20.38,47.89 v20,47.51 | C1.1 42.35,35.16 41.5,36.01 22.5,36.01 22,37.01 | C13.1 20.45,37.01 22,37.01 | SV1.2 43.27,43.24 45,41.51 45.5,41.51 45.95,41.06 R1.2
  Bottom 0.406: v47.5,39.51 47.5,37.01 45,34.51 43.52,34.51 43.01,34 43.01,30.5 43.03,30.48
  Bottom 0.61: 43.03,30.48 43.03,28.04 v43,28.01 | v41,23.01 41.5,23.01 42,22.51 42,18.51 41.5,18.01 40,18.01 39,17.01 v39,14.01 39,9.01 40.5,7.51 48,7.51 v49.5,9.01 | v61.5,13.51 60,15.01 60,25.51 59,26.51 48.04,26.51 v47,26.55
  other vias: 22,47.51 24,47.51 26,47.51 20,45.51 22,45.51 24,45.51 26,45.51 22,43.51 26,43.51 22,41.51 24,41.51 26,41.51 20,43.51 20,41.51
  pour Top: 19,40.51 27,40.51 27,48.51 19,48.51
  pour Bottom: 19,40.51 27,40.51 27,48.51 19,48.51
  pour Top: 19,54.01 19.5,54.51 23.5,54.51 24,54.01 24,50.01 23.5,49.51 19.5,49.51 19,50.01
+5V  (via drill 0.4)
  Top 0.254: 25.07,27.51 U4.4
  Top 0.406: v31,41.51 v31,43.51 | SV2.2 69.4,55.31 66.5,55.31
  Top 0.61: U7.2 34,42.51 | U4.12 31.86,26.37 v32.5,26.51 | v23.5,26.51 23.5,27.01 24,27.51 25.07,27.51 | U4.16 32.24,31.45 v32.5,31.71 | U5.1 28.41,14.6 28,15.01 v28,20.01 | v54,42.51 54.5,42.51 55.42,41.58 LED1.4 | LED2.A 60,42.51 59,43.51 v55.5,43.51
  Top 0.813: U8.3 27.9,39.41 28.5,40.01 C12.1 28.65,41.51 v31,41.51 | 66.5,55.31 66,54.81 66,51.01 61,46.01 56,46.01 55.5,45.51 v55.5,43.51 54.5,42.51 | v31,47.51 29.5,47.51 28,49.01 JP3.7 | v54,42.51 v52,42.51 v50,42.51
  Bottom 0.61: 28,26.51 v32.5,26.51 v32.5,31.71 32.5,37.91 U7.2 34,42.51 v33,43.51 | 28,26.51 v23.5,26.51 | v28,20.01 28,26.51
  Bottom 0.813: v37,41.51 38,42.51 v50,42.51 v52,42.51 v54,42.51 54.5,42.51 v55.5,43.51
  other vias: 33,47.51 35,47.51 37,47.51 31,45.51 33,45.51 35,45.51 37,45.51 35,43.51 37,43.51 35,41.51 33,41.51
  pour Top: 30,40.51 38,40.51 38,48.51 30,48.51
  pour Bottom: 30,40.51 38,40.51 38,48.51 30,48.51
  pour Top: 25,54.51 28.5,54.51 29,54.01 29,50.01 28.5,49.51 25,49.51 24.5,50.01 24.5,54.01
+10V  (via drill 0.4)
  Top 0.406: 36.1,39.2 U7.3
  Top 0.61: 61.2,48.91 61.2,50.86
  Top 0.813: 58.5,47.81 55.1,47.81 54.65,48.26 R9.2 54.65,47.86 | 58.5,47.81 60.1,47.81 61.2,48.91 | R13.2 44.5,58.26 v44.5,57.01 v41.5,57.01 | v55,47.51 v58,47.51 58.2,47.51 58.5,47.81 | U7.3 36.71,39.01 40,39.01 | C11.1 40,39.01 | 40,39.01 v42,39.01
  Bottom 0.813: v56.5,47.51 v55,47.51 50,47.51 49.5,48.01 49.5,56.51 49,57.01 v44.5,57.01 v43,57.01 v41.5,57.01 31,57.01 30.54,56.55 JP3.10 | v56.5,47.51 58.5,47.51 | v56.5,47.51 57,47.01 57,42.51 55.5,41.01 44,41.01 v42,39.01 v38,39.01
  pour Top: 30,54.51 31,54.51 31.5,54.01 31.5,50.01 31,49.51 30,49.51 29.5,50.01 29.5,54.01
  pour Top: 59,56.51 64.5,56.51 65,56.01 65,51.51 62.5,49.01 60,49.01 60,51.51 59,52.51
A1
  Top 0.254: JP5.8 21.35,26.51 22,26.51 24,28.51 24,29.51 24.68,30.18 U4.2
A2
  Top 0.254: U4.10 31.68,23.83 32.4,23.11 32.4,22.21 31.7,21.51 28,21.51 27,20.51 23.5,20.51 21.96,18.97 JP5.14
A_IN0
  Top 0.254: 37.65,14.16 U2.3 | 36.65,14.16 U2.3 | U2.3 36.15,14.16 36,14.01 36,13.51 35,12.51 35,12.01 33.5,10.51 27,10.51 26.5,10.01 25.5,10.01 25.07,9.58 JP4.19
A_IN1
  Top 0.254: 37.35,12.86 U2.5 36.35,12.86 35.5,12.01 35.5,11.51 34,10.01 28,10.01 27.61,9.62 JP4.17
A_IN2
  Top 0.254: U2.10 40.35,12.86 40,12.51 40,11.51 39.5,11.01 37,11.01 35,9.01 30.5,9.01 30.15,8.66 JP4.15
A_IN3
  Top 0.254: U2.12 45.15,14.16 45.5,13.81 45.5,12.51 45,12.01 44.5,12.01 44,11.51 44,11.01 43,10.01 38,10.01 36,8.01 33.5,8.01 32.69,7.2 JP4.13
A_IN4
  Top 0.254: 47.15,13.16 U3.3 46.65,13.16 46.5,13.01 46.5,11.51 46,11.01 45.5,11.01 45,10.51 45,10.01 44,9.01 39,9.01 37,7.01 35.5,7.01 35.23,6.74 JP4.11
A_IN5
  Top 0.254: U3.5 48.65,11.86 49,11.51 49,10.51 48.5,10.01 48.5,9.01 47.5,8.01 40,8.01 37.77,5.78 JP4.9
A_IN6  (via drill 0.4)
  Top 0.254: v41.5,1.01 48.5,1.01 50.5,3.01 54,3.01 54.65,2.36 R14.3
  Bottom 0.254: JP4.7 41.5,3.59 v41.5,1.01
A_IN7  (via drill 0.4)
  Top 0.254: v58.5,3.01 59.65,1.86 R15.3
  Bottom 0.254: JP4.5 44,3.63 44,1.51 44.5,1.01 48.5,1.01 50,2.51 51.5,2.51 52.5,3.51 58,3.51 v58.5,3.01
A_IN8  (via drill 0.4)
  Top 0.254: v64,3.51 64.65,2.86 R16.3
  Bottom 0.254: JP4.3 46.66,3.51 49,3.51 49.5,3.01 51,3.01 52,4.01 63.5,4.01 v64,3.51
AN0
  Top 0.254: JP4.20 24,3.31 24,10.01 24.5,10.51 26,10.51 26.5,11.01 33,11.01 34.5,12.51 34.5,13.01 35.5,14.01 35.5,14.51 35.8,14.81 U2.2 | U2.2 U2.1 37.1,16.61 37.5,17.01 45,17.01 45.5,17.51 45.43,17.58 U1.19 | 37.3,14.81 U2.2 | 36.8,14.81 U2.2
AN1
  Top 0.254: U2.7 U2.6 39.2,12.21 39.5,12.51 39.5,13.01 40,13.51 40,16.01 40.5,16.51 45.5,16.51 46.23,17.24 U1.20 | JP4.18 28.9,3.53 28.9,8.91 29.5,9.51 34.5,9.51 36.55,11.56 U2.7 | 38.05,11.56 U2.7
AN2  (via drill 0.4)
  Top 0.254: JP4.16 31.4,3.49 31.4,7.91 32,8.51 35.5,8.51 37.5,10.51 42.5,10.51 43,11.01 43,11.46 U2.8 U2.9 42.7,12.01 v41,12.01 | v41,15.01 42,16.01 46,16.01 47.03,17.04 U1.21
  Bottom 0.254: v41,15.01 v41,12.01
AN3
  Top 0.254: U2.14 U2.13 45.2,14.81 46,14.01 46,12.01 45.5,11.51 45,11.51 44.5,11.01 44.5,10.51 43.5,9.51 38.5,9.51 36.5,7.51 34.5,7.51 34,7.01 34,3.55 JP4.14 | U2.14 43,15.56 | U1.22 47.83,16.84 46.5,15.51 43.95,15.51 U2.14
AN4  (via drill 0.4)
  Top 0.254: JP4.12 36.5,3.51 36.5,6.01 37,6.51 37.5,6.51 39.5,8.51 45,8.51 45.5,9.01 v46,9.01 | U3.1 U3.2 v49,13.81 | U1.23 49.63,22.14 48.5,21.01 48.5,15.36 U3.1 | 47.5,14.56 U3.1
  Bottom 0.254: v49,13.81 46.3,13.81 46,13.51 v46,9.01
AN5  (via drill 0.4)
  Top 0.254: U3.6 U3.7 47.5,10.46 v47.5,9.71 | U1.24 50.66,23.35 51,23.01 51,22.01 50.5,21.51 50,21.51 49,20.51 49,16.01 50,15.01 v50,13.01 50,12.51 50.5,12.01 50.5,8.51 50,8.01 48.5,8.01 48,7.51 40.5,7.51 39,6.01 39,3.47 JP4.10
  Bottom 0.254: v47.5,9.71 46.5,10.71 46.5,12.51 47,13.01 v50,13.01
AN6
  Top 0.254: U3.9 U3.8 51.55,10.56 51.25,10.26 | JP4.8 40.73,2.24 41.6,3.11 41.6,5.61 43,7.01 48.5,7.01 49,7.51 50.5,7.51 51,8.01 51,10.01 51.25,10.26 | U1.25 49.77,24.01 51,24.01 51.5,23.51 51.5,21.51 51,21.01 50.5,21.01 49.5,20.01 49.55,19.96 49.5,19.91 49.5,16.51 50.5,15.51 50.5,14.01 51,13.51 51,10.51 51.25,10.26
AN7
  Top 0.254: U3.13 U3.14 52.55,14.46 52.5,14.51 51.5,14.51 51,15.01 51,16.01 50,17.01 50,19.51 51,20.51 51.5,20.51 52,21.01 52,24.01 51,25.01 49.69,25.01 U1.26 | U3.13 53.5,13.91 | JP4.6 44.1,3.49 44.1,6.01 44.6,6.51 49,6.51 49.5,7.01 51,7.01 51.5,7.51 51.5,9.51 52,10.01 54.5,10.01 55,10.51 55,13.51 54.7,13.81 U3.13
AN8
  Top 0.254: JP4.4 46.6,3.45 46.6,5.51 47.1,6.01 49.5,6.01 50,6.51 51.2,6.51 52,7.31 52,9.01 52.5,9.51 55,9.51 55.5,10.01 55.5,14.01 56,14.51 | 56,14.51 62.5,14.51 62.9,14.11 U9.14 U9.13 | U1.27 51.26,25.75 52.5,24.51 52.5,20.51 52,20.01 51.5,20.01 50.5,19.01 50.5,17.51 51.5,16.51 51.5,15.51 52,15.01 54.5,15.01 55,14.51 56,14.51
B1
  Top 0.254: U4.6 25.11,25.01 24,25.01 23,24.01 21.31,24.01 JP5.10
B2
  Top 0.254: 25.5,18.51 U5.5 25.3,18.51 23.5,18.51 21.42,16.43 JP5.16
BLUE
  Top 0.254: R3.1 49.85,36.36 51.5,38.01 54,38.01 54.58,38.58 LED1.2
CS0
  Top 0.254: JP5.19 18.73,11.84 19.5,12.61 23.9,12.61 24.5,13.01 31,13.01 32.5,14.51 32.5,15.01 33.5,16.01 33.5,20.51 34,21.01 39.57,21.01 U1.12
CS1
  Top 0.254: JP5.20 21.93,12.01 24.5,12.01 25,12.51 31.5,12.51 33,14.01 33,14.51 34,15.51 34,20.01 34.5,20.51 38.5,20.51 39.5,19.51 40.5,19.51 40.63,19.64 U1.13
GND  (via drill 0.4)
  Top 0.254: U6.5 51.5,53.01 U6.PAD 51,54.01 51,55.51 48.5,58.01 C9.1 | U1.39 43.83,33.34 44.13,33.34 v44.5,33.71 | U3.11 v51.8,12.51
  Top 0.406: U1.6 38.07,26.51 v40,26.51 | v42.5,23.51 43.03,22.98 U1.16 43.03,18.39 C2.2 | v47.5,28.01 48.16,27.35 U1.29 51.39,27.35 C3.2 | C12.2 v28.5,45.51 | C4.2 34.29,24.01 v36.4,24.01 | U2.11 44,13.51 v44.5,13.01 | 64.5,12.01 v64.7,12.01
  Top 0.61: LED3.C 38.35,58.51 v36.5,58.51 | R14.1 51.5,1.51 51,1.01 v49.9,1.01 | R15.1 56.5,1.51 56,2.01 v56,6.51 56.5,6.51 57,7.01 57,7.36 R18.1 | R16.1 61.5,1.51 61,2.01 v61,6.51 61,7.01 61.15,7.01 R19.1 | U5.4 30.6,19.91 v30.5,20.01 | U4.8 24.36,22.56 v23.5,22.51 | R7.1 v63.5,21.01 63.75,21.26 | 63.75,21.26 64.35,21.86 C6.2 | 63.75,21.26 63.75,20.76 64.5,20.01 64.5,16.66 C7.2 65,16.51 65.5,16.01 65.5,13.01 64.5,12.01 U9.11 | R6.1 v63.5,28.01 | v63.5,28.01 64.85,29.36 C5.2 64.85,34.16 v64,35.01 R5.1 | C1.2 42.25,37.31 v41.2,37.31 | C11.2 40.05,42.01 | R17.1 v53,8.01 | v63.5,28.01 64.4,27.11 64.4,23.01 | C14.2 59.5,51.01 v58,49.51
  Top 0.813: JP5.1 18.73,37.03 C13.2 18.65,38.66 v19,39.01 20.29,39.01 U8.1 | U7.1 30.4,39.41 v30,39.01 | 40.05,42.01 40,42.01 39,43.01 39,46.51 v39.5,47.01
  Bottom 0.254: v51.8,12.51 53.5,12.51 53.5,8.01 v53,8.01
  Bottom 0.61: v36.5,58.51 36,59.01 35.5,59.01
  other vias: 52.5,54.01 53,51.51 53,46.01
  pour Bottom (isolate 0.305, rank 3): 0,65.01 73.5,65.01 73.5,0.01 0,0.01
  pour Top: 51,46.01 51,55.51 51.5,56.01 53.5,56.01 54,55.51 54,52.51 54.5,52.01 55,52.01 55.5,51.51 55.5,50.51 55,50.01 54,50.01 54,45.01 51.5,45.01
GPIO1  (via drill 0.4)
  Top 0.254: 49.77,28.01 U1.30 51.14,28.15 51.5,28.51 51.5,29.01 52,29.51 53,29.51 53.5,29.01 53.5,26.01 53,25.51 53,20.01 v51.5,18.51 | JP4.1 48.36,5.21 v49.7,5.21
  Bottom 0.254: v49.7,5.21 50.5,6.01 53.5,6.01 54.5,7.01 54.5,16.51 54,17.01 53.5,17.01 53,17.51 52,17.51 51.5,18.01 v51.5,18.51
GPIO2  (via drill 0.4)
  Top 0.254: U1.31 50.44,28.95 51.5,30.01 53.5,30.01 54,29.51 54,25.51 53.5,25.01 53.5,19.51 53,19.01 v53,18.51 | JP4.2 v49.7,4.01
  Bottom 0.254: v49.7,4.01 50.7,5.01 54,5.01 55,6.01 55,17.01 54.5,17.51 54,17.51 v53,18.51
GREEN
  Top 0.254: LED1.3 52.85,38.51 51,38.51 50,37.51 48.5,37.51 47.5,36.51 R4.1
I1
  Top 0.254: U4.14 28.91,28.91 28.5,28.51 28.5,23.71 26.3,21.51 JP5.12
I2
  Top 0.254: U5.7 26.64,15.87 27,15.51 27,14.01 26.5,13.51 24.5,13.51 24.12,13.89 JP5.18
INDX1
  Top 0.254: U4.13 31.64,27.64 32,28.01 32,29.51 32.5,30.01 34.7,30.01 36.56,28.15 U1.4
INDX2
  Top 0.254: U5.3 31.64,17.14 32.5,18.01 32.5,21.51 33,22.01 36,22.01 37.34,23.35 U1.10
MISO  (via drill 0.4)
  Top 0.254: U1.37 45.43,29.58 v46,29.01
  Bottom 0.254: v46,29.01 46,32.01 47,33.01 66.5,33.01 67,32.51 67,31.51 67.29,31.22 SV2.21
MOSI  (via drill 0.4)
  Top 0.254: U1.38 44.63,28.38 v45,28.01
  Bottom 0.254: v45,28.01 45,32.51 46,33.51 67.92,33.51 SV2.19
N$1
  Top 0.254: R15.2 59.35,6.36 R18.2 | R18.2 59,8.36 | U9.5 59.65,11.36 60,11.01 60,8.51 59.5,8.01 R18.2
N$2
  Top 0.254: U1.7 35.75,25.75 C4.1
N$3
  Top 0.254: X2.2 33,55.51
  Top 0.305: U6.1 47.5,55.01 R12.2
  Top 0.406: 47.5,55.01 47.5,56.01
  Top 0.813: C8.1 48.2,50.01 47.5,50.01 | 47.5,56.01 46.65,56.86 C9.2
  Top 1.27: 33,55.51 33,56.51 34.5,56.51 35.5,55.51 | 35.5,55.51 33,55.51 | 33,55.51 32.5,55.51 | 35.5,55.51 40,55.51
  pour Top: 39,56.51 48.5,56.51 49.2,56.01 49.2,49.51 48.5,49.01 39,49.01 38.5,49.51 38.5,56.01
  pour Top (rank 2): 32,64.01 34,64.01 35,63.01 35,56.01 34,55.01 19,55.01 17.5,56.01 30,56.01 31,57.01 31,63.01
  pour Top: 6,21.51 7,20.51 16,20.51 17,21.51 17,54.01 18,55.01 20,55.01 20,56.01 16,56.01 15,55.01 15,31.01 14,30.01 7.5,30.01 7,30.01 6,29.01
N$4
  Top 0.254: U9.12 64.15,12.66 64.5,13.01 64.5,14.51 64,15.01 63,15.01 62.5,15.51 62.5,16.36 C7.1 60.5,16.51 60,17.01 R7.2
N$5  (via drill 0.4)
  Top 0.254: C5.1 R5.2 59.5,36.01 59,36.51 57,36.51 55,34.51 55,25.01 v54.5,24.51 | U3.10 52.35,11.86 v52,11.51
  Bottom 0.254: v52,11.51 51.5,11.51 51,12.01 51,17.51 50.5,18.01 50.5,19.01 51.5,20.01 53,20.01 53.5,20.51 53.5,23.51 v54.5,24.51
N$7
  pour Top: 7,20.01 16,20.01 17,19.01 17,10.51 16,9.51 7,9.51 6,10.51 6,19.01
N$10
  Top 0.254: U9.3 56.15,12.66 56,12.51 56,8.66 R17.2 55.5,7.66 55.5,7.51 55,7.01 53.5,7.01 53,6.51 R14.2
N$16  (via drill 0.4)
  Top 0.254: U9.6 U9.7 58.95,10.06 v59,10.01 | R6.3 56.5,28.01 56,27.51 v56,18.51
  Bottom 0.254: v56,18.51 56,15.01 56.5,14.51 59.5,14.51 60,14.01 60,10.51 59.5,10.01 v59,10.01
N$18  (via drill 0.4)
  Top 0.254: U9.8 U9.9 61.3,10.71 v61,11.01 | v61,15.51 57.5,15.51 57,16.01 57,20.16 R7.3
  Bottom 0.254: v61,15.51 65.5,15.51 66,15.01 66,11.01 65.5,10.51 61.5,10.51 v61,11.01
N$23
  Top 0.61: R13.1 LED3.A
N$25
  Top 0.254: R8.2 54.45,37.01 59.5,37.01 60,37.51 LED2.C
N$28
  Top 0.254: U1.35 47,32.38 47,34.01 47.5,34.51 R4.2
N$29
  Top 0.254: U1.34 49.6,34.12 R3.2
N$30
  Top 0.254: R2.2 49.63,32.59 U1.33
N$31
  Top 0.254: R16.2 63.85,5.86 R19.2 64,8.16 64,11.01 63.65,11.36 U9.10
N$32
  Top 0.254: U1.32 50.24,29.75 51,30.51 51,32.51 52,33.51 53.5,33.51 53.8,33.81 R8.1
N$33
  Top 0.305: 55.5,56.01 56,55.51 56,54.81 55.7,54.51 U6.9
  Top 0.61: C10.1 53.5,58.01 55.5,56.01
  Top 0.813: C10.1 52.35,58.56 55.2,61.41 D1.C
  pour Top: 53.5,64.01 54,64.51 64.5,64.51 65,64.01 65,62.01 64.5,61.51 54,61.51 53.5,62.01
N$35
  Top 0.305: U6.6 55.8,53.01 56.3,52.51 56.3,51.06 R10.2 R9.1
N$36
  Top 0.305: U6.2 49.3,54.51 48,53.21 47.65,53.21 R12.1
N$37
  Top 0.305: U6.4 49.2,53.51 48.7,53.01 48.7,51.41 49.1,51.01 C15.1
N$38
  Top 0.305: R11.2 57.55,54.86 57.2,55.21 56.5,55.21 56.5,54.61 56.3,54.41 | 55.9,54.01 56.7,54.01 57.2,54.51 57.2,55.01 56.8,55.01 56.8,54.71 56.7,54.61 56.9,54.61 56.9,54.71 | 56.9,54.71 57,54.81 | 56.9,54.71 56.4,54.21 56.6,54.21 56.8,54.41 56.3,54.41 | 56.3,54.41 55.9,54.01 | 55.9,54.01 U6.8
  Top 0.61: D1.A 57.7,56.16 57.7,55.91 | 57.7,55.91 57.2,55.91 | 57.2,55.91 54.9,58.21 | 57.2,55.91 57.7,55.41 | 57.7,55.41 57.7,55.91 | 57.7,55.41 R11.2
N$39
  Top 0.305: C10.2 50.65,56.86 50.9,56.61 53.8,56.61 54.9,55.51 U6.10
N$40
  Top 0.305: U6.7 56,53.51 | 56,53.51 56.7,52.81 57.1,52.81 57.1,53.51 56.4,53.51 | 56,53.51 56.4,53.51 | 56.4,53.51 56.9,53.01 56.9,53.21 56.8,53.31 57.55,53.31 R11.1
N$44  (via drill 0.4)
  Top 0.254: U9.2 U9.1 58.55,13.96 v59,13.51 | R5.3 56.5,35.01 55.5,34.01 55.5,19.51 v54.5,18.51
  Bottom 0.254: v54.5,18.51 55.5,17.51 55.5,14.51 56.05,13.96 58.5,13.96 58.95,13.51 v59,13.51
N$57  (via drill 0.4)
  Top 0.254: 60,24.51 R6.2 | C6.1 61.15,24.01 R6.2 | R6.2 58.5,23.01 v57,23.01 | v54.5,23.01 54.2,22.71 54.2,19.51 53.7,19.01 53.7,17.71 53,17.01 v53,16.01 | v51.9,13.61 52.25,13.16 U3.12
  Bottom 0.254: v57,23.01 v54.5,23.01 | v53,16.01 53,14.41 v51.9,13.61
OC1
  Top 0.254: JP5.21 20.03,10.11 22.1,10.11 23.5,11.51 25,11.51 25.5,12.01 32,12.01 33.5,13.51 33.5,14.01 34.5,15.01 34.5,19.51 35,20.01 38,20.01 39,19.01 41,19.01 41.43,19.44 U1.14
OC2
  Top 0.254: JP5.22 21.8,8.81 24,11.01 25.5,11.01 26,11.51 32.5,11.51 34,13.01 34,13.51 35,14.51 35,19.01 35.5,19.51 37.5,19.51 38.5,18.51 41.5,18.51 42.23,19.24 U1.15
PGEC  (via drill 0.4)
  Top 0.254: U1.9 38.17,24.01 40,24.01 41.5,25.51 41.5,27.51 41,28.01 41,28.51 41.5,29.01 v41.5,29.51 | v45.5,36.51 45.5,37.01 46,37.51 47,37.51 47.5,38.01 49,38.01 49.5,38.51 49.5,41.51 49,42.01 49,43.01 49.5,43.51 50,43.51 50.89,44.4 SV1.5
  Bottom 0.254: v41.5,29.51 41.5,30.01 41,30.51 41,35.01 41.5,35.51 44.5,35.51 v45.5,36.51
PGED  (via drill 0.4)
  Top 0.254: U1.8 38.09,25.01 40,25.01 41,26.01 41,27.01 40.5,27.51 40.5,28.51 40,29.01 v40,29.51 | v45,38.01 46.5,38.01 47,38.51 48.5,38.51 49,39.01 49,41.01 48.35,41.66 SV1.4
  Bottom 0.254: v40,29.51 40,30.01 40.5,30.51 40.5,35.51 41,36.01 44,36.01 44.5,36.51 44.5,37.51 v45,38.01
QEA1
  Top 0.254: U4.3 25.91,28.91 26,29.01 26.5,29.01 27,29.51 27,30.01 29.5,32.51 36,32.51 36.5,32.01 36.5,30.01 36.76,29.75 U1.2
QEA2
  Top 0.254: U4.11 32.99,25.1 33.4,25.51 33.4,28.01 33.9,28.51 35.4,28.51 36.56,27.35 U1.5
QEB1
  Top 0.254: U4.5 26.86,26.37 27.5,27.01 27.5,29.41 28.9,30.81 35.2,30.81 36,30.01 36,29.51 36.56,28.95 U1.3
QEB2
  Top 0.254: U1.11 37,21.51 33.5,21.51 33,21.01 33,16.51 32.37,15.87 U5.2
RED
  Top 0.254: R2.1 52.85,37.51 55,37.51 55.42,37.93 LED1.1
SCK  (via drill 0.4)
  Top 0.254: v47,30.01 46.23,30.78 U1.36
  Bottom 0.254: SV2.23 66.5,30.35 66.5,32.01 66,32.51 47.5,32.51 47,32.01 v47,30.01
SCK2
  Top 0.254: JP5.2 22,34.94 22,35.01 41,35.01 42.23,33.78 U1.41
SCL1
  Top 0.254: JP5.5 18.73,29.64 19.5,30.41 21.9,30.41 22.5,31.01 22.5,32.01 24,33.51 39.5,33.51 40,33.01 39.83,32.84 U1.44
SDA1
  Top 0.254: JP5.6 21.65,29.51 22.5,29.51 23,30.01 23,31.51 24.5,33.01 37.5,33.01 38,32.51 38.03,32.04 U1.1
SDI2
  Top 0.254: JP5.3 18.73,32.24 19.5,33.01 22,33.01 22.5,33.51 22.5,34.01 23,34.51 40.5,34.51 41.43,33.58 U1.42
SDO2
  Top 0.254: JP5.4 23.61,34.01 40,34.01 40.63,33.38 U1.43
VDD
  Top 1.27: X1.2 15.27,59.74 18,57.01 22,57.01 24.73,59.74 X2.1
  pour Top: 11.5,64.01 14.5,64.01 15.5,63.01 15.5,60.51 18.5,57.51 21.5,57.51 24.5,60.51 24.5,63.01 25.5,64.01 29.5,64.01 30.5,63.01 30.5,57.51 29.5,56.51 11.5,56.51 10.5,57.51 10.5,63.01
  pour Top: 15.5,57.51 10.5,57.51 9.5,56.51 9.5,31.51 10.5,30.51 13.5,30.51 14.5,31.51 14.5,55.51 15.5,56.51

### Text on the board
tPlace: +3V3 | +5V | +10V | GND | REV A | AN6 | SPI | I2C | AN7 | RC Filters | ENC1 | AN8 | ENC2 | MRRL | !SS | RasPIC GoPack | PWM | AN0 | AN1 | AN2 | AN3 | AN4 | AN5 | AN6 | AN7 | AN8 | GPIO
tNames: Supply / Voltage | Power Switch | Hi Power / Killswitch | Hi Power / Supply Out